# Altium schematic sheet SunS_fixture_EGSE_UART_Isolation.SchDoc: Connectors
size A4; Author: Michał Gumiela; ProjectName: SunS
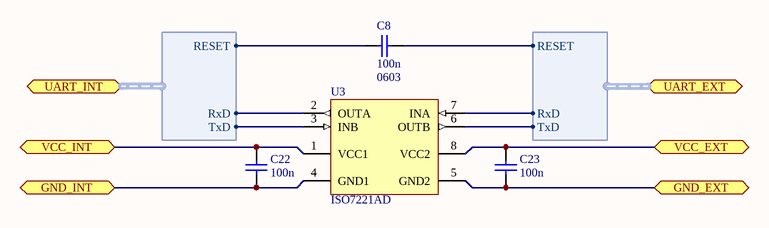
[diagram p0: SunS_fixture_EGSE_UART_Isolation.SchDoc]

## Parts
C8  value 100n  Package: 0603  [SMD_Capacitor_0603]  (hidden comment: Cap)
C22  value 100n  [SMD_Capacitor_0603]  (hidden comment: Cap)
C23  value 100n  [SMD_Capacitor_0603]  (hidden comment: Cap)
U3  ISO7221AD  [D0008A_N]

## Ports
GND_EXT, GND_INT, UART_EXT (harness UART), UART_INT (harness UART), VCC_EXT, VCC_INT

## Harnesses
UART: TxD, RxD, RESET

## Nets
GND_EXT: C23.2 U3.5(GND2) ; port GND_EXT
GND_INT: C22.2 U3.4(GND1) ; port GND_INT
VCC_EXT: C23.1 U3.8(VCC2) ; port VCC_EXT
VCC_INT: C22.1 U3.1(VCC1) ; port VCC_INT
NetC8_1: C8.1 ; port UART_INT.RESET
NetC8_2: C8.2 ; port UART_EXT.RESET
NetU3_2: U3.2(OUTA) ; port UART_INT.RxD
NetU3_3: U3.3(INB) ; port UART_INT.TxD
NetU3_6: U3.6(OUTB) ; port UART_EXT.TxD
NetU3_7: U3.7(INA) ; port UART_EXT.RxD

## Notes on the sheet
- Title:
- Project:
- Author:
- Model:
- Document Number:
- Checked by:
- Rev:
- Date:
- Approved by:
- Sheet:
- of
- File name:

## Library data of the parts
U3 = ISO7221AD: 1 Mbps Dual Channels, 1 / 1, Digital Isolator, 3.3 V / 5 V, -40 to +125 degC, 8-pin SOIC (D), Green (RoHS & no Sb/Br); Manufacturer: Texas Instruments; Datarate(Mbps): 1; Input Noise Filter: Yes; Insulation Rating(VRMS): 2500; Prop Delay(Max)(ns): 475; Rating: Catalog; Supply Voltage(s)(V): 3.3, 5; TTL/CMOS Input Threshold: TTL; DatasheetVersion: SLLS755L; PackageVersion: 4040047-3/M, 06/2011; PackageReference: D0008A; PackageDescription: 8-Pin Plastic Small Outline, Body 4.9 x 3.9 mm, Pitch 1.27 mm; Supplier 1: Digi-Key; Supplier Part Number 1: 296-26077-5-ND; Supplier 2: Farnell; Supplier Part Number 2: 1390651; Supplier 3: Newark; Supplier Part Number 3: 48M0672; Supplier 4: Mouser; Supplier Part Number 4: 595-ISO7221AD; Eco-Plan: Green (RoHS & no Sb/Br); SubFamily: Isolator; Thermal Shutdown: No; MountType: SMT; Code_JEDEC: MS-012; PartNumber: ISO7221AD; ComponentLink1Description: Manufacturer URL; ComponentLink1URL: http://www.ti.com/; ComponentLink2Description: Datasheet; ComponentLink2URL: http://www.ti.com/general/docs/lit/getliterature.tsp?genericPartNumber=ISO7221A&fileType=pdf; ComponentLink3Description: Package Specification; ComponentLink3URL: http://www.ti.com/litv/pdf/msoi002j; ComponentLink4Description: SamplesURL; ComponentLink4URL: http://www.ti.com/product/iso7221a#samples
C8 C22 C23 = Cap
  C22 C23: Package: 0603